# EAGLE design button (EAGLE 9.0.0)
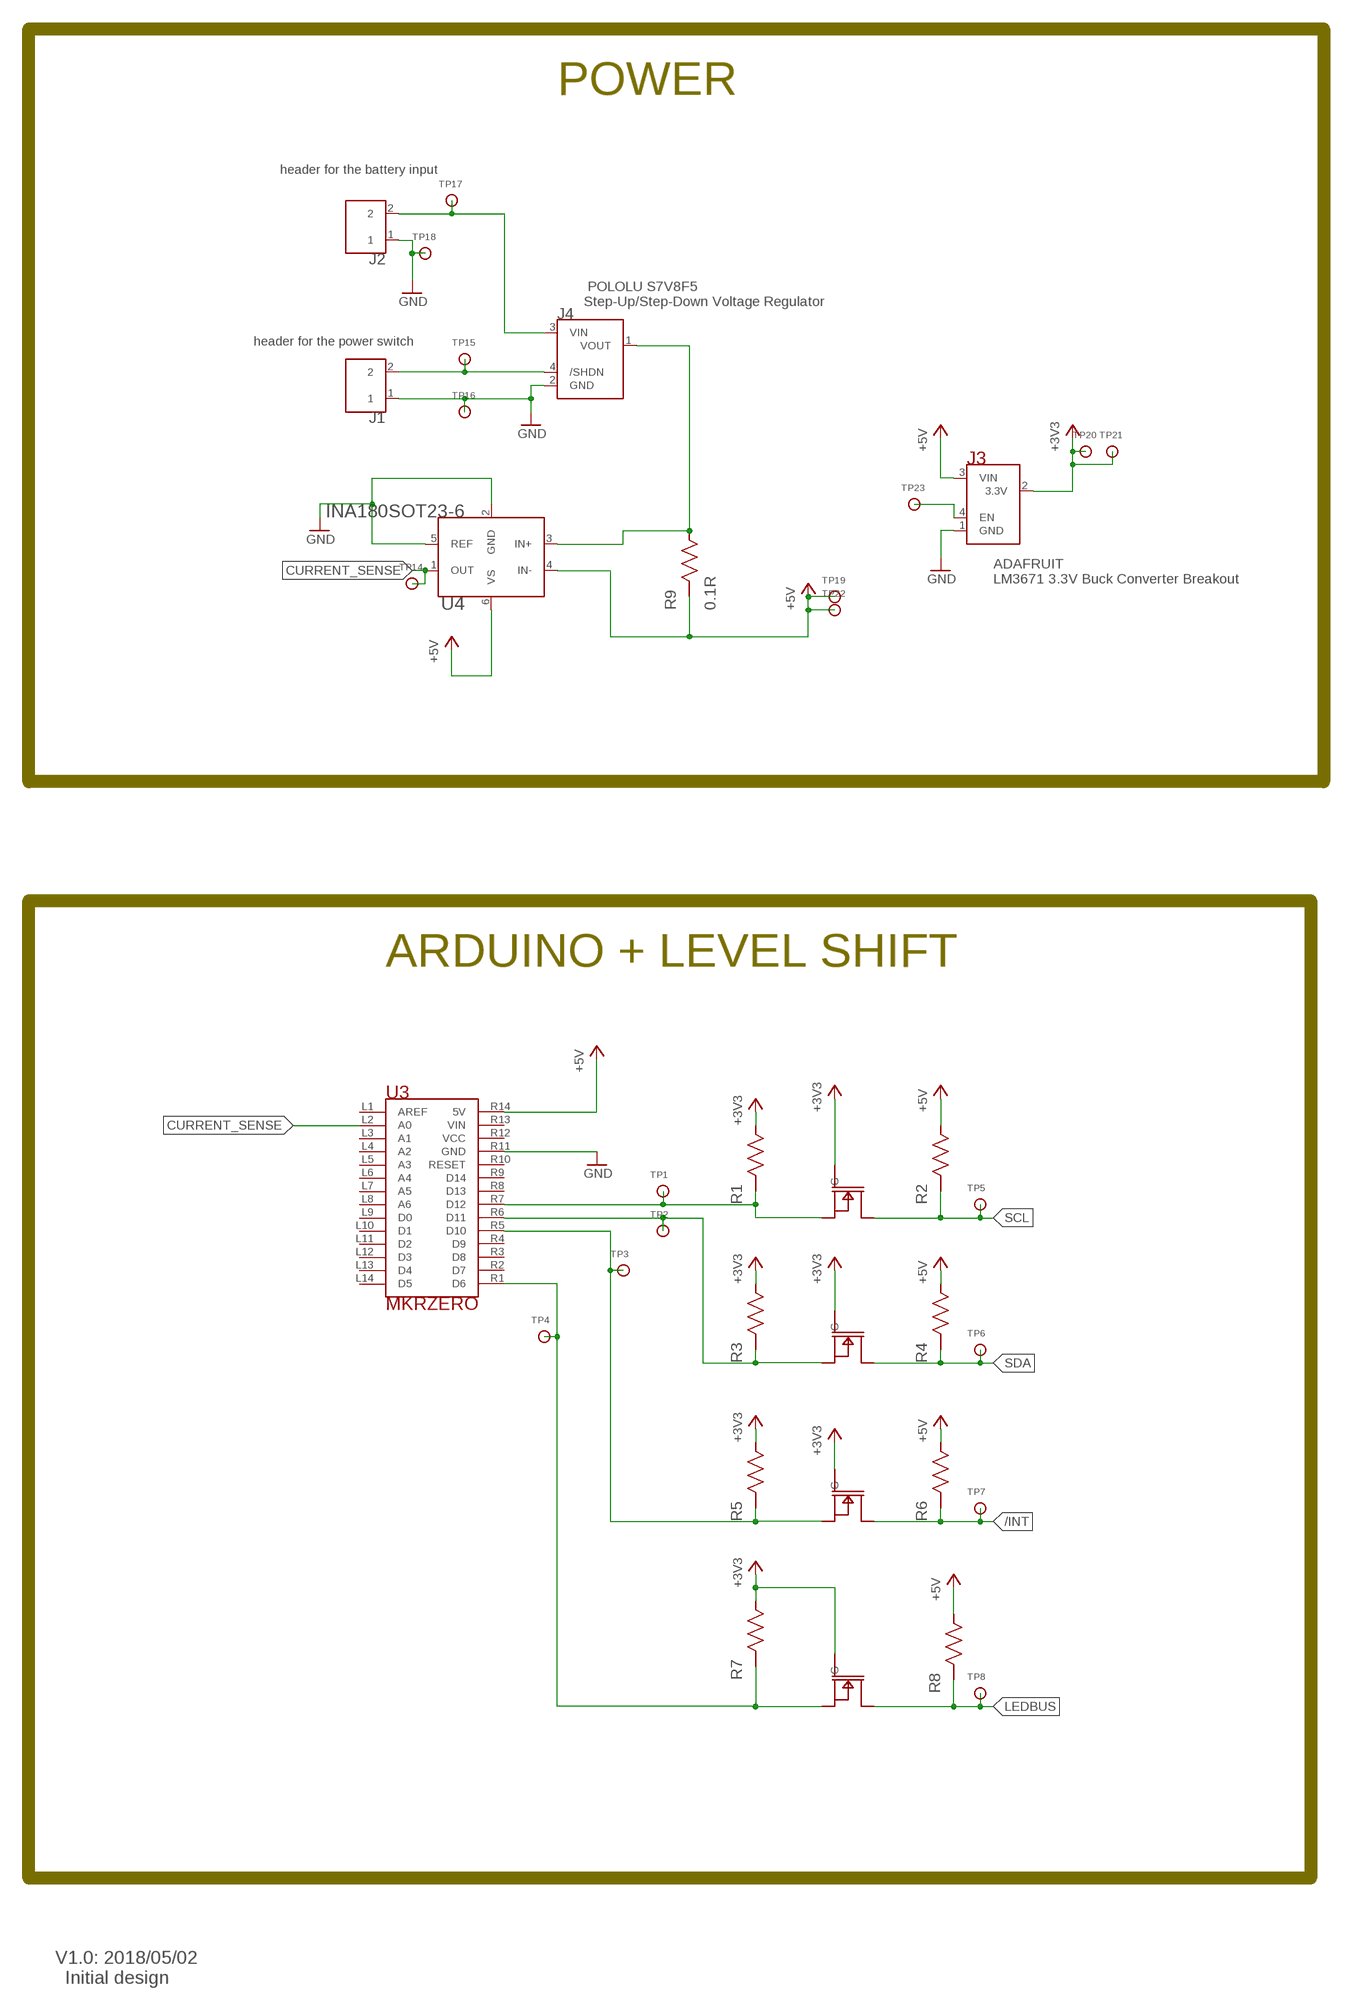
[diagram p0: schematic, sheet 1, part 1 of 2]
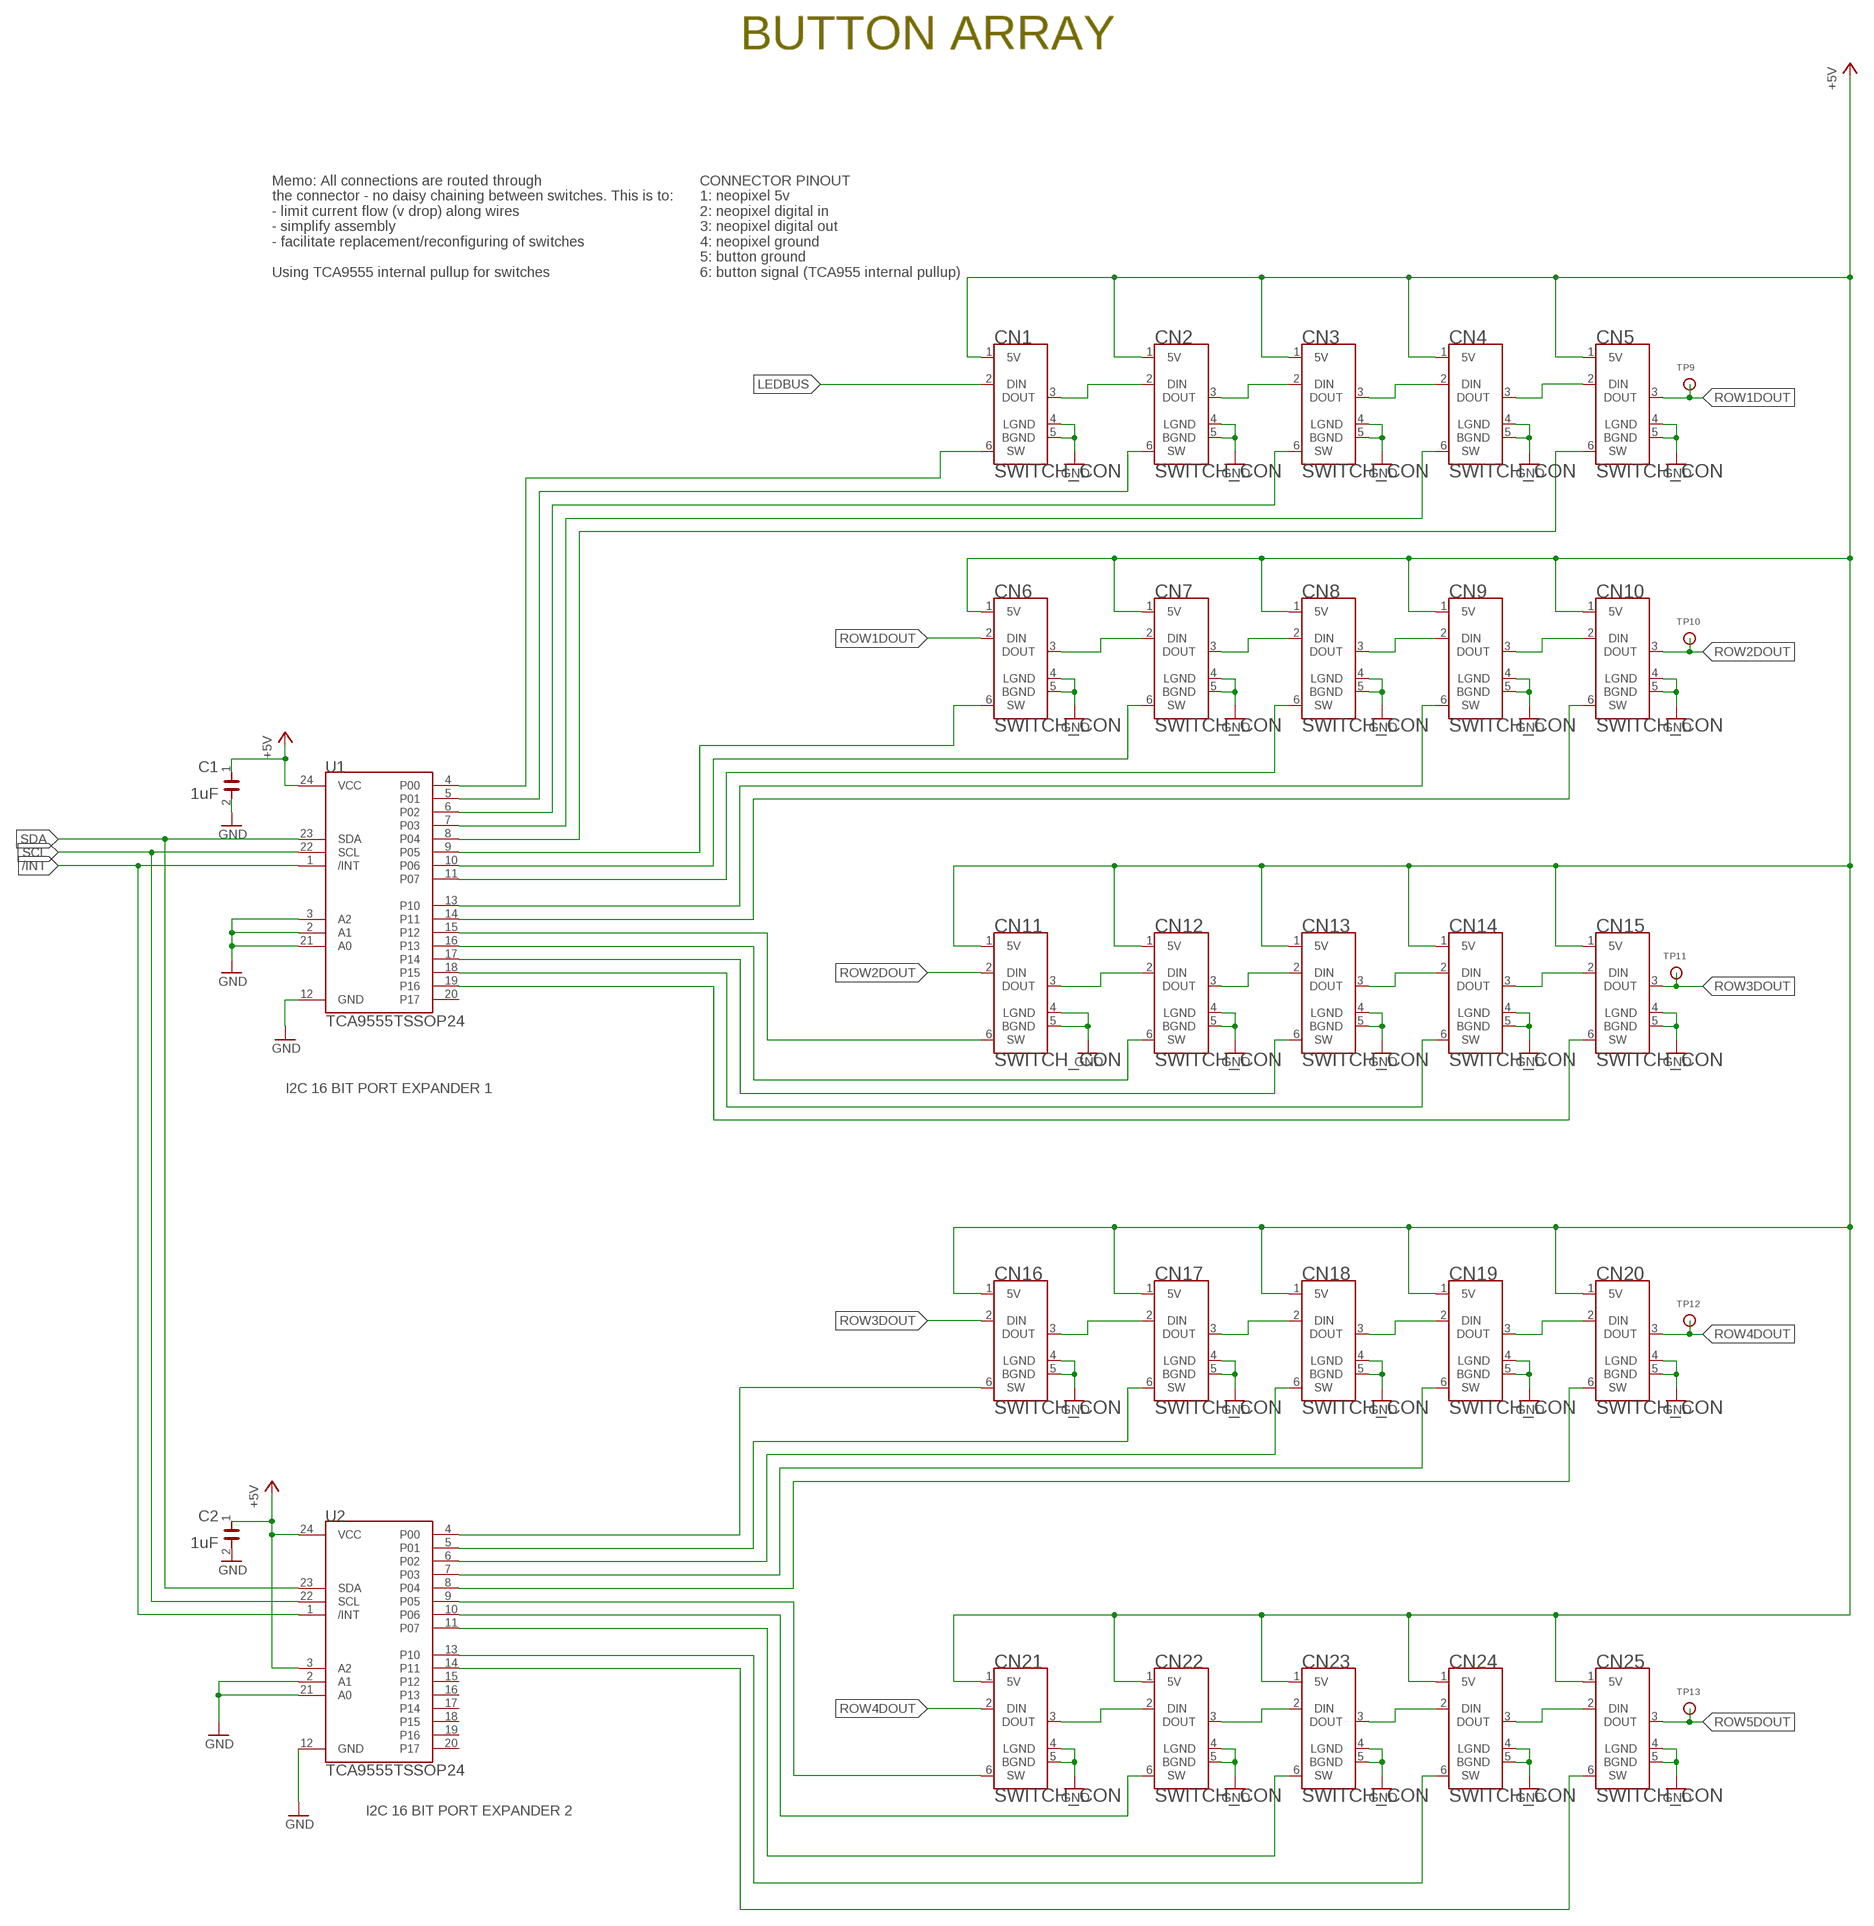
[diagram p1: schematic, sheet 1, part 2 of 2]

## Parts
C1  1uF  CAPACITOR  [R0805]
C2  1uF  CAPACITOR  [R0805]
CN1  SWITCH_CON  [JST_XH6]
CN2  SWITCH_CON  [JST_XH6]
CN3  SWITCH_CON  [JST_XH6]
CN4  SWITCH_CON  [JST_XH6]
CN5  SWITCH_CON  [JST_XH6]
CN6  SWITCH_CON  [JST_XH6]
CN7  SWITCH_CON  [JST_XH6]
CN8  SWITCH_CON  [JST_XH6]
CN9  SWITCH_CON  [JST_XH6]
CN10  SWITCH_CON  [JST_XH6]
CN11  SWITCH_CON  [JST_XH6]
CN12  SWITCH_CON  [JST_XH6]
CN13  SWITCH_CON  [JST_XH6]
CN14  SWITCH_CON  [JST_XH6]
CN15  SWITCH_CON  [JST_XH6]
CN16  SWITCH_CON  [JST_XH6]
CN17  SWITCH_CON  [JST_XH6]
CN18  SWITCH_CON  [JST_XH6]
CN19  SWITCH_CON  [JST_XH6]
CN20  SWITCH_CON  [JST_XH6]
CN21  SWITCH_CON  [JST_XH6]
CN22  SWITCH_CON  [JST_XH6]
CN23  SWITCH_CON  [JST_XH6]
CN24  SWITCH_CON  [JST_XH6]
CN25  SWITCH_CON  [JST_XH6]
J1  2WAY_JUMPER  [2PIN_HEADER]
J2  2WAY_JUMPER  [2PIN_HEADER]
J3  ADA-2745_3V3REG  [4PIN_HEADER]
J4  S7V8F5  [4PIN_HEADER]
Q1  BSS138SOT23  [SOT23]
Q2  BSS138SOT23  [SOT23]
Q3  BSS138SOT23  [SOT23]
Q4  BSS138SOT23  [SOT23]
R1  RESISTOR8085  [R0805]
R2  RESISTOR8085  [R0805]
R3  RESISTOR8085  [R0805]
R4  RESISTOR8085  [R0805]
R5  RESISTOR8085  [R0805]
R6  RESISTOR8085  [R0805]
R7  RESISTOR8085  [R0805]
R8  RESISTOR8085  [R0805]
R9  0.1R  PT1206FR-070R1L1206  [R1206]
TP1  TEST_POINT  [TESTPAD_2MM]
TP2  TEST_POINT  [TESTPAD_2MM]
TP3  TEST_POINT  [TESTPAD_2MM]
TP4  TEST_POINT  [TESTPAD_2MM]
TP5  TEST_POINT  [TESTPAD_2MM]
TP6  TEST_POINT  [TESTPAD_2MM]
TP7  TEST_POINT  [TESTPAD_2MM]
TP8  TEST_POINT  [TESTPAD_2MM]
TP9  TEST_POINT  [TESTPAD_2MM]
TP10  TEST_POINT  [TESTPAD_2MM]
TP11  TEST_POINT  [TESTPAD_2MM]
TP12  TEST_POINT  [TESTPAD_2MM]
TP13  TEST_POINT  [TESTPAD_2MM]
TP14  TEST_POINT  [TESTPAD_2MM]
TP15  TEST_POINT  [TESTPAD_2MM]
TP16  TEST_POINT  [TESTPAD_2MM]
TP17  TEST_POINT  [TESTPAD_2MM]
TP18  TEST_POINT  [TESTPAD_2MM]
TP19  TEST_POINT  [TESTPAD_2MM]
TP20  TEST_POINT  [TESTPAD_2MM]
TP21  TEST_POINT  [TESTPAD_2MM]
TP22  TEST_POINT  [TESTPAD_2MM]
TP23  TEST_POINT  [TESTPAD_2MM]
U1  TCA9555TSSOP24  [SOP65P640X120-24]
U2  TCA9555TSSOP24  [SOP65P640X120-24]
U3  MKRZERO  ATMEL_MLRZERO  [ARDUINO_MKR]
U4  INA180SOT23-6  [SOT95P290X145-6]

## Nets
+3V3: J3.2(3.3V) Q1.1(G) Q2.1(G) Q3.1(G) Q4.1(G) R1.2 R3.2 R5.2 R7.2 TP20.P$1 TP21.P$1
+5V: C1.1 C2.1 CN1.1(5V) CN2.1(5V) CN3.1(5V) CN4.1(5V) CN5.1(5V) CN6.1(5V) CN7.1(5V) CN8.1(5V) CN9.1(5V) CN10.1(5V) CN11.1(5V) CN12.1(5V) CN13.1(5V) CN14.1(5V) CN15.1(5V) CN16.1(5V) CN17.1(5V) CN18.1(5V) CN19.1(5V) CN20.1(5V) CN21.1(5V) CN22.1(5V) CN23.1(5V) CN24.1(5V) CN25.1(5V) J3.3(VIN) R2.2 R4.2 R6.2 R8.2 R9.1 TP19.P$1 TP22.P$1 U1.24(VCC) U2.3(A2) U2.24(VCC) U3.R14(5V) U4.4(IN-) U4.6(VS)
/INT: Q2.3(D) R6.1 TP7.P$1 U1.1(/INT) U2.1(/INT)
CURRENT_SENSE: TP14.P$1 U3.L2(A0) U4.1(OUT)
GND: C1.2 C2.2 CN1.4(LGND) CN1.5(BGND) CN2.4(LGND) CN2.5(BGND) CN3.4(LGND) CN3.5(BGND) CN4.4(LGND) CN4.5(BGND) CN5.4(LGND) CN5.5(BGND) CN6.4(LGND) CN6.5(BGND) CN7.4(LGND) CN7.5(BGND) CN8.4(LGND) CN8.5(BGND) CN9.4(LGND) CN9.5(BGND) CN10.4(LGND) CN10.5(BGND) CN11.4(LGND) CN11.5(BGND) CN12.4(LGND) CN12.5(BGND) CN13.4(LGND) CN13.5(BGND) CN14.4(LGND) CN14.5(BGND) CN15.4(LGND) CN15.5(BGND) CN16.4(LGND) CN16.5(BGND) CN17.4(LGND) CN17.5(BGND) CN18.4(LGND) CN18.5(BGND) CN19.4(LGND) CN19.5(BGND) CN20.4(LGND) CN20.5(BGND) CN21.4(LGND) CN21.5(BGND) CN22.4(LGND) CN22.5(BGND) CN23.4(LGND) CN23.5(BGND) CN24.4(LGND) CN24.5(BGND) CN25.4(LGND) CN25.5(BGND) J1.1 J2.1 J3.1(GND) J4.2(GND) TP16.P$1 TP18.P$1 U1.2(A1) U1.3(A2) U1.12(GND) U1.21(A0) U2.2(A1) U2.12(GND) U2.21(A0) U3.R11(GND) U4.2(GND) U4.5(REF)
LEDBUS: CN1.2(DIN) Q4.3(D) R8.1 TP8.P$1
N$1: CN23.3(DOUT) CN24.2(DIN)
N$2: CN24.3(DOUT) CN25.2(DIN)
N$3: CN1.6(SW) U1.4(P00)
N$4: CN2.6(SW) U1.5(P01)
N$5: CN3.6(SW) U1.6(P02)
N$6: J3.4(EN) TP23.P$1
N$7: CN1.3(DOUT) CN2.2(DIN)
N$8: CN2.3(DOUT) CN3.2(DIN)
N$9: CN3.3(DOUT) CN4.2(DIN)
N$10: CN4.3(DOUT) CN5.2(DIN)
N$11: CN6.3(DOUT) CN7.2(DIN)
N$12: CN7.3(DOUT) CN8.2(DIN)
N$13: CN8.3(DOUT) CN9.2(DIN)
N$14: CN9.3(DOUT) CN10.2(DIN)
N$15: CN11.3(DOUT) CN12.2(DIN)
N$16: CN12.3(DOUT) CN13.2(DIN)
N$17: CN13.3(DOUT) CN14.2(DIN)
N$18: CN14.3(DOUT) CN15.2(DIN)
N$19: CN16.3(DOUT) CN17.2(DIN)
N$20: CN17.3(DOUT) CN18.2(DIN)
N$21: CN18.3(DOUT) CN19.2(DIN)
N$22: CN19.3(DOUT) CN20.2(DIN)
N$23: CN21.3(DOUT) CN22.2(DIN)
N$24: CN22.3(DOUT) CN23.2(DIN)
N$25: CN4.6(SW) U1.7(P03)
N$26: CN5.6(SW) U1.8(P04)
N$27: CN6.6(SW) U1.9(P05)
N$28: CN7.6(SW) U1.10(P06)
N$29: CN8.6(SW) U1.11(P07)
N$30: CN9.6(SW) U1.13(P10)
N$31: CN10.6(SW) U1.14(P11)
N$32: CN11.6(SW) U1.15(P12)
N$33: CN12.6(SW) U1.16(P13)
N$34: CN13.6(SW) U1.17(P14)
N$35: CN14.6(SW) U1.18(P15)
N$36: CN15.6(SW) U1.19(P16)
N$37: CN16.6(SW) U2.4(P00)
N$38: CN17.6(SW) U2.5(P01)
N$39: CN18.6(SW) U2.6(P02)
N$40: CN19.6(SW) U2.7(P03)
N$41: CN20.6(SW) U2.8(P04)
N$42: Q3.2(S) R1.1 TP1.P$1 U3.R7(D12)
N$43: CN21.6(SW) U2.9(P05)
N$44: CN22.6(SW) U2.10(P06)
N$45: CN23.6(SW) U2.11(P07)
N$46: CN24.6(SW) U2.13(P10)
N$47: CN25.6(SW) U2.14(P11)
N$48: Q4.2(S) R7.1 TP4.P$1 U3.R1(D6)
N$49: Q1.2(S) R3.1 TP2.P$1 U3.R6(D11)
N$50: J1.2 J4.4(/SHDN) TP15.P$1
N$51: J2.2 J4.3(VIN) TP17.P$1
N$52: Q2.2(S) R5.1 TP3.P$1 U3.R5(D10)
N$54: J4.1(VOUT) R9.2 U4.3(IN+)
ROW1DOUT: CN5.3(DOUT) CN6.2(DIN) TP9.P$1
ROW2DOUT: CN10.3(DOUT) CN11.2(DIN) TP10.P$1
ROW3DOUT: CN15.3(DOUT) CN16.2(DIN) TP11.P$1
ROW4DOUT: CN20.3(DOUT) CN21.2(DIN) TP12.P$1
ROW5DOUT: CN25.3(DOUT) TP13.P$1
SCL: Q3.3(D) R2.1 TP5.P$1 U1.22(SCL) U2.22(SCL)
SDA: Q1.3(D) R4.1 TP6.P$1 U1.23(SDA) U2.23(SDA)
Unconnected: U1.20(P17) U2.15(P12) U2.16(P13) U2.17(P14) U2.18(P15) U2.19(P16) U2.20(P17) U3.L1(AREF) U3.L3(A1) U3.L4(A2) U3.L5(A3) U3.L6(A4) U3.L7(A5) U3.L8(A6) U3.L9(D0) U3.L10(D1) U3.L11(D2) U3.L12(D3) U3.L13(D4) U3.L14(D5) U3.R2(D7) U3.R3(D8) U3.R4(D9) U3.R8(D13) U3.R9(D14) U3.R10(RESET) U3.R12(VCC) U3.R13(VIN)

## Notes on the sheet
- POWER | BUTTON ARRAY
- header for the battery input
- POLOLU S7V8F5
  Step-Up/Step-Down Voltage Regulator
- Memo: All connections are routed through
  the connector - no daisy chaining between switches. This is to:
  - limit current flow (v drop) along wires
  - simplify assembly
  - facilitate replacement/reconfiguring of switches
  
  Using TCA9555 internal pullup for switches
- CONNECTOR PINOUT
  1: neopixel 5v
  2: neopixel digital in
  3: neopixel digital out
  4: neopixel ground
  5: button ground
  6: button signal (TCA955 internal pullup)
- header for the power switch
- ADAFRUIT
  LM3671 3.3V Buck Converter Breakout
- ARDUINO + LEVEL SHIFT
- I2C 16 BIT PORT EXPANDER 1
- I2C 16 BIT PORT EXPANDER 2
- V1.0: 2018/05/02
    Initial design

## Library data of the parts
C1 C2 = button_lib:CAPACITOR
CN1-CN25 = button_lib:SWITCH_CON
J1 J2 = button_lib:2WAY_JUMPER
J3 = button_lib:ADA-2745_3V3REG
J4 = button_lib:S7V8F5
Q1-Q4 = button_lib:BSS138
R1-R8 = button_lib:RESISTOR
R9 = button_lib:PT1206FR-070R1L: 0.1R 0.25W PT1206FR-070R1L
TP1-TP23 = button_lib:TEST_POINT
U1 U2 = button_lib:TCA9555
U3 = button_lib:ATMEL_MLRZERO
U4 = button_lib:INA180

## Board
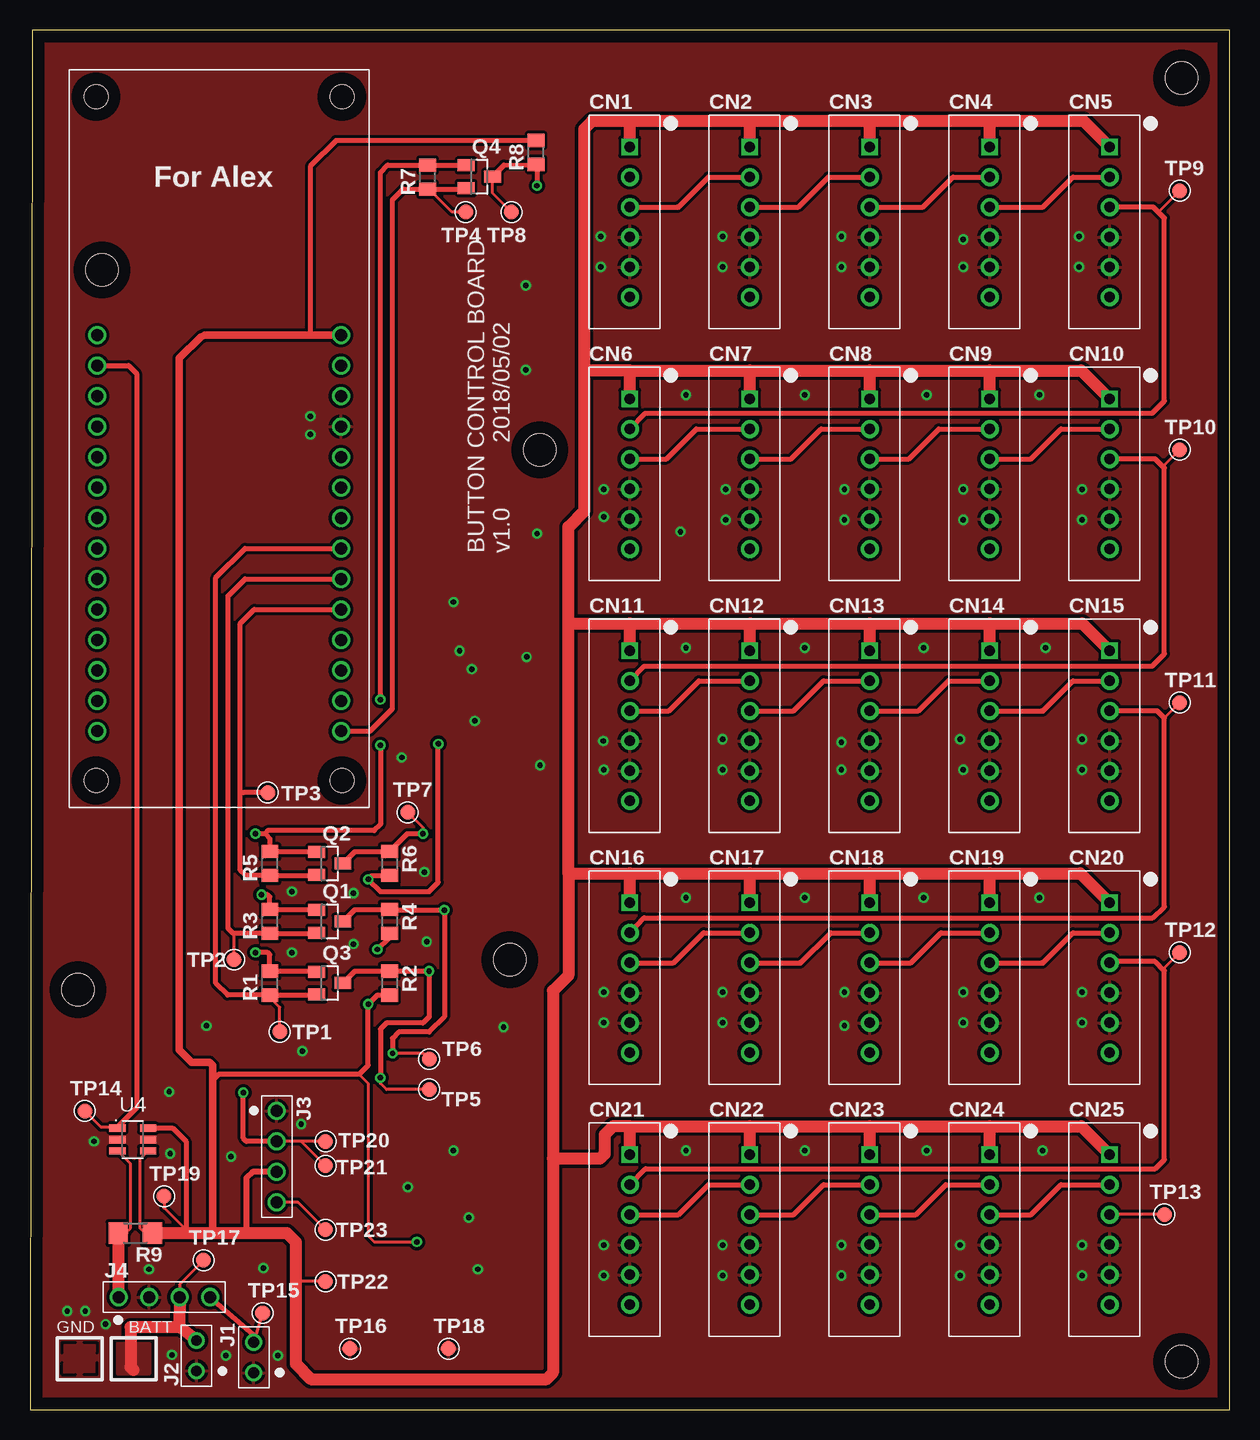
[diagram p2: board, top side]
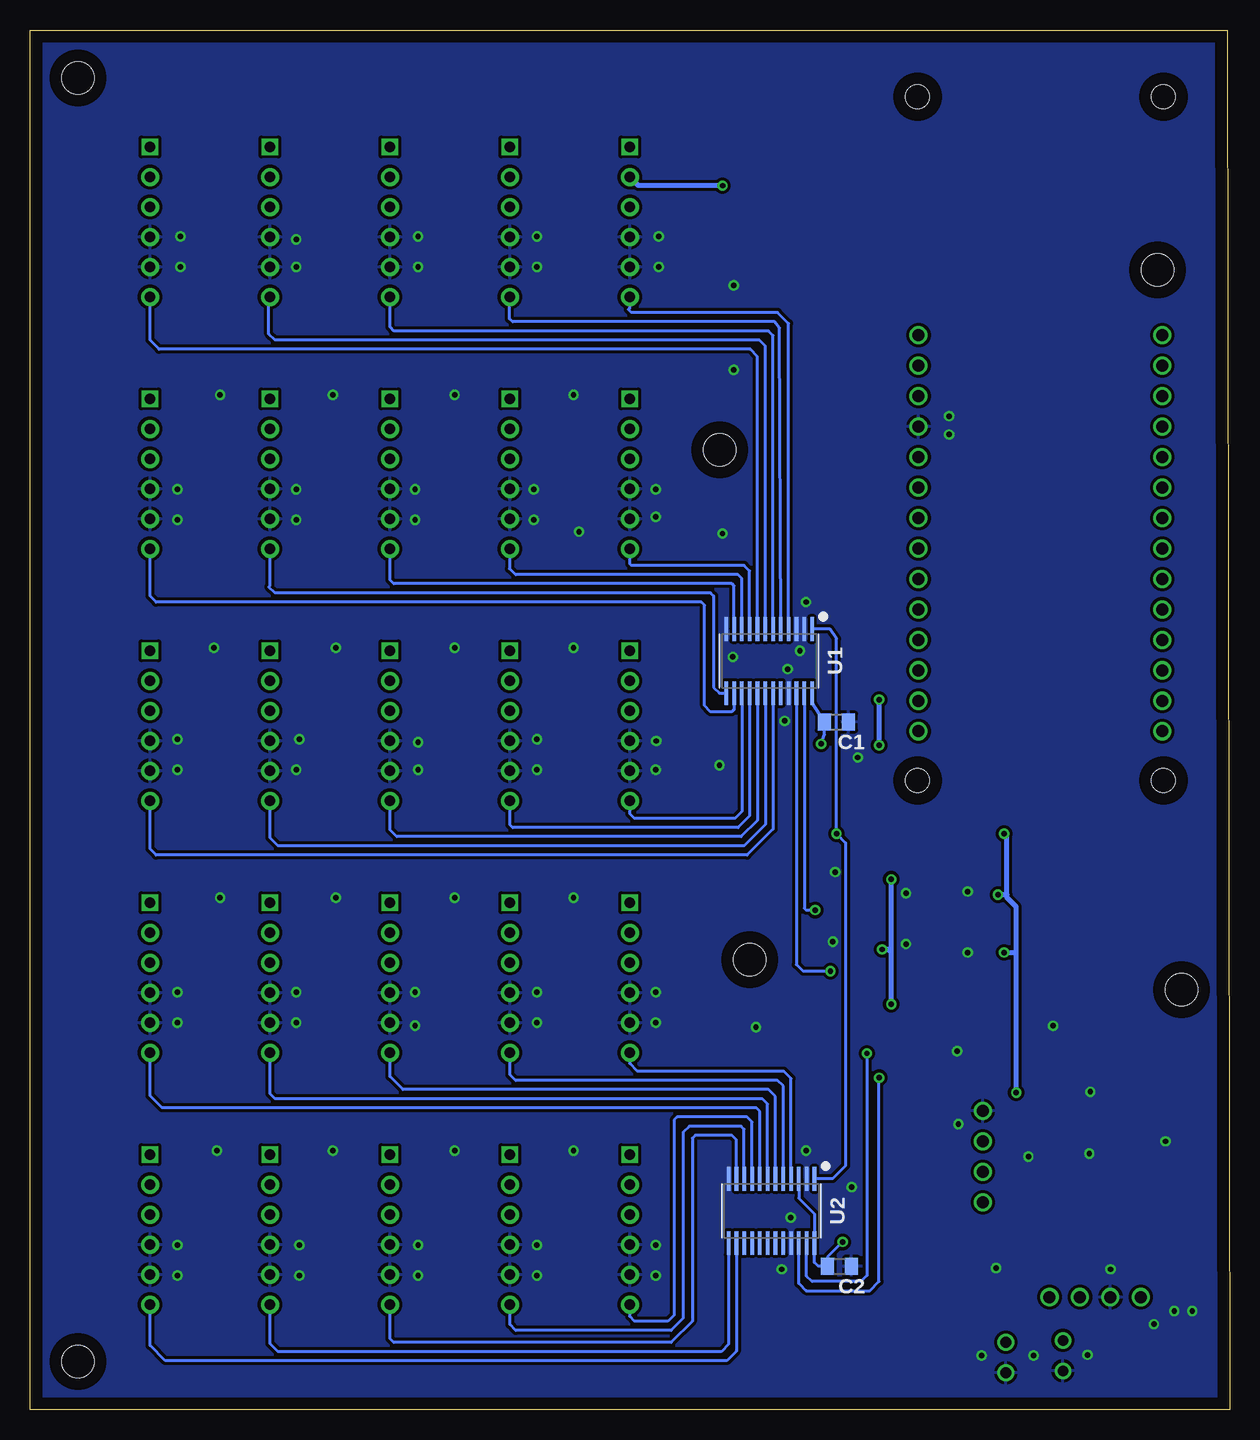
[diagram p3: board, bottom side, seen from below]

Size 100 x 115 mm. Coordinates in mm from the lower left corner, seen from the top.
Outline: 0,0 100,0 100,115 0.2,115 0,0
Copper layers (1*16): Top 0.035mm / dielectric 1.5mm / Bottom 0.035mm
Design rules "default *": minimum track width 6mil, minimum drill 0.35mm, track to track 10mil, track to pad 8mil, pad to pad 8mil, via to via 10mil, smd to smd 6mil, copper to edge 40mil, drill to drill 6mil, minimum pad ring 10mil, minimum via ring 8mil, stop-mask expansion 4mil, vias tented up to drill 0mil, thermal gap 10mil
Holes 2.7 mm at 96,111 96,4 40,37.5 42.5,80 6,95 4,35
tRestrict: 8 lines

### Footprints (pad centres in the part's own frame; a part is rotated, then mirrored left to right if it is on the bottom)
R0805 = smd 1.1 x 1.4: 1 -1,0; 2 1,0
JST_XH6 = drill 0.9 square: 1 -6.25,0 | drill 0.9 pad 1.5: 2 -3.75,0; 3 -1.25,0; 4 1.25,0; 5 3.75,0; 6 6.25,0
2PIN_HEADER = drill 0.9: 1 -1.27,0; 2 1.27,0
4PIN_HEADER = drill 1: 1 -3.81,0; 2 -1.27,0; 3 1.27,0; 4 3.81,0
SOT23 = smd 1 x 1.4: 1 -0.95,-1.1; 2 0.95,-1.1; 3 0,1.1
R1206 = smd 1.6 x 1.803: 1 -1.422,0; 2 1.422,0
TESTPAD_2MM = smd 1.27 x 1.27: P$1 0,0
SOP65P640X120-24 = smd 1.968 x 0.3: 1 -2.673,3.575; 2 -2.673,2.925; 3 -2.673,2.275; 4 -2.673,1.625; 5 -2.673,0.975; 6 -2.673,0.325; 7 -2.673,-0.325; 8 -2.673,-0.975; 9 -2.673,-1.625; 10 -2.673,-2.275; 11 -2.673,-2.925; 12 -2.673,-3.575; 13 2.673,-3.575; 14 2.673,-2.925; 15 2.673,-2.275; 16 2.673,-1.625; 17 2.673,-0.975; 18 2.673,-0.325; 19 2.673,0.325; 20 2.673,0.975; 21 2.673,1.625; 22 2.673,2.275; 23 2.673,2.925; 24 2.673,3.575
ARDUINO_MKR = drill 1 pad 1.5: L1 2.34,39.37; L2 2.34,36.83; L3 2.34,34.29; L4 2.34,31.75; L5 2.34,29.21; L6 2.34,26.67; L7 2.34,24.13; L8 2.34,21.59; L9 2.34,19.05; L10 2.34,16.51; L11 2.34,13.97; L12 2.34,11.43; L13 2.34,8.89; L14 2.34,6.35; R1 22.66,6.35; R2 22.66,8.89; R3 22.66,11.43; R4 22.66,13.97; R5 22.66,16.51; R6 22.66,19.05; R7 22.66,21.59; R8 22.66,24.13; R9 22.66,26.67; R10 22.66,29.21; R11 22.66,31.75; R12 22.66,34.29; R13 22.66,36.83; R14 22.66,39.37 | hole 2: 2.25,2.25; 22.75,2.25; 22.75,59.25; 2.25,59.25
SOT95P290X145-6 = smd 1.35 x 0.609: 1 -1.28,0.95; 2 -1.28,0; 3 -1.28,-0.95; 4 1.28,-0.95; 5 1.28,0; 6 1.28,0.95

### Placement (x,y rotation side)
C1  32.77,57.31 0 bottom
C2  32.51,11.94 0 bottom
CN1  50,99 270 top
CN2  60,99 270 top
CN3  70,99 270 top
CN4  80,99 270 top
CN5  90,99 270 top
CN6  50,78 270 top
CN7  60,78 270 top
CN8  70,78 270 top
CN9  80,78 270 top
CN10  90,78 270 top
CN11  50,57 270 top
CN12  60,57 270 top
CN13  70,57 270 top
CN14  80,57 270 top
CN15  90,57 270 top
CN16  50,36 270 top
CN17  60,36 270 top
CN18  70,36 270 top
CN19  80,36 270 top
CN20  90,36 270 top
CN21  50,15 270 top
CN22  60,15 270 top
CN23  70,15 270 top
CN24  80,15 270 top
CN25  90,15 270 top
J1  18.65,4.34 90 top
J2  13.88,4.48 90 top
J3  20.57,21.08 270 top
J4  11.19,9.37 0 top
Q1  24.99,40.68 270 top
Q2  24.99,45.51 270 top
Q3  24.99,35.55 270 top
Q4  37.46,102.77 270 top
R1  19.99,35.55 90 top
R2  29.97,35.55 270 top
R3  19.99,40.68 90 top
R4  29.97,40.68 270 top
R5  19.99,45.51 90 top
R6  29.97,45.51 270 top
R7  33.15,102.73 90 top
R8  42.18,104.78 90 top
R9  8.78,14.71 180 top
TP1  20.83,31.5 90 top
TP2  17.02,37.5 0 top
TP3  19.82,51.42 180 top
TP4  36.32,99.82 180 top
TP5  33.27,26.67 270 top
TP6  33.27,29.21 270 top
TP7  31.5,49.78 0 top
TP8  40.13,99.82 180 top
TP9  95.84,101.6 0 top
TP10  95.84,80.01 0 top
TP11  95.84,58.93 0 top
TP12  95.84,38.1 0 top
TP13  94.57,16.26 0 top
TP14  4.57,24.89 0 top
TP15  19.4,8.04 0 top
TP16  26.67,5.08 0 top
TP17  14.48,12.45 0 top
TP18  34.88,5.08 0 top
TP19  11.18,17.78 0 top
TP20  24.64,22.35 0 top
TP21  24.64,20.32 180 top
TP22  24.64,10.67 0 top
TP23  24.64,14.99 0 top
U1  38.38,62.39 270 bottom
U2  38.18,16.56 270 bottom
U3  3.26,50.19 0 top
U4  8.58,22.51 0 top

### Tracks (layer width: path | path; a pad name or v marks a point on that pad's centre or on a via)
+3V3  (via drill 0.45)
  Top 0.254: TP20.P$1 22.61,22.35 | 22.61,22.35 J3.2 | TP21.P$1 22.61,22.35
  Top 0.406: Q4.1 R7.2 29.82,103.73 29.21,103.12 v29.21,59.18 | Q2.1 23.84,46.51 R5.2 19.99,47.57 19.66,48.01 | Q1.1 23.84,41.68 R3.2 19.99,42.75 19.81,42.93 v19.3,42.93 | Q3.1 23.84,36.55 R1.2 19.99,37.92 19.81,38.1 v18.8,38.1 | J3.2 18.03,22.35 17.78,22.61 v17.78,26.42 | v18.8,48.01 19.66,48.01 | v29.21,55.37 29.21,48.77 28.7,48.26 19.81,48.26 19.66,48.01
  Top 0.508: 19.81,46.69 R5.2
  Bottom 0.406: v17.78,26.42 17.78,38.1 | 17.78,38.1 17.78,41.91 18.54,42.67 18.54,42.93 | 18.54,42.93 18.54,48.01 v18.8,48.01 | v19.3,42.93 18.54,42.93 | v18.8,38.1 17.78,38.1 | v29.21,59.18 v29.21,55.37
+5V  (via drill 0.45)
  Top 0.254: U4.4 9.18,20.88 9.18,15.11 9.38,14.91 10,14.91 | 27.43,27.94 28.19,27.18 28.19,14.48 28.7,13.97 v32.26,13.97 | TP19.P$1 11.18,16.81 13,14.99 | TP22.P$1 22.15,10.67
  Top 0.406: R9.1 10,14.91 | U4.6 11.89,23.46 13,22.35 13,14.99 13,14.71 | v28.96,38.35 29.97,39.37 R4.2 | R6.2 28.51,44.51 v28.19,44.2 29.21,43.18 33.27,43.18 34.04,43.94 v34.04,55.49 | R8.2 25.52,105.78 23.37,103.63 23.37,89.56 | R2.2 28.96,34.55 v28.19,33.78 28.19,28.7 27.43,27.94 15.75,27.94 15.24,27.43
  Top 0.508: J3.3 18.54,19.81 18.03,19.3 18.03,14.71
  Top 0.61: U3.R14 23.37,89.56 14.58,89.56 14.22,89.41 12.45,87.63 12.45,29.97 13.46,28.96 14.99,28.96 15.24,28.7 15.24,27.43 15.24,14.71
  Top 1.016: R9.1 13,14.71 15.24,14.71 18.03,14.71 21.4,14.71 22.15,13.97 22.15,10.67 22.15,3.81 23.42,2.54 43.07,2.54 43.6,3.07 43.6,20.9 | 44.88,44.7 44.88,65.53 | 50,23.62 60,23.62 | 60,23.62 70,23.62 | 70,23.62 80,23.62 | 80,23.62 87.63,23.62 CN25.1 | 44.88,44.7 50,44.7 | 50,44.7 60,44.7 | 60,44.7 70,44.7 | 70,44.7 80,44.7 | 80,44.7 87.55,44.7 CN20.1 | 44.88,65.53 50,65.53 | 50,65.53 60.02,65.53 | 60.02,65.53 70,65.53 | 70,65.53 80,65.53 | 80,65.53 87.72,65.53 CN15.1 | 50,86.61 60,86.61 | 60,86.61 70,86.61 | 70,86.61 80,86.61 | 80,86.61 87.64,86.61 CN10.1 | 50.12,107.44 46.89,107.44 46.2,106.73 46.2,86.6 | 50.12,107.44 60.02,107.44 | 60.02,107.44 70,107.44 | 70,107.44 80,107.44 | 80,107.44 87.81,107.44 CN5.1 | CN2.1 60,107.42 60.02,107.44 | CN1.1 50,107.32 50.12,107.44 | CN3.1 70,107.44 | CN4.1 80,107.44 | CN6.1 50,86.61 | CN7.1 60,86.61 | CN8.1 70,86.61 | CN9.1 80,86.61 | CN11.1 50,65.53 | CN12.1 60.02,63.25 60.02,65.53 | CN13.1 70,65.53 | CN14.1 80,65.53 | CN16.1 50,44.7 | CN17.1 60,44.7 | CN18.1 70,44.7 | CN19.1 80,44.7 | CN21.1 50,23.62 | CN22.1 60,23.62 | CN23.1 70,23.62 | CN24.1 80,23.62 | 44.88,44.7 44.88,36.18 43.6,34.9 43.6,20.9 | 50,23.62 48.62,23.62 47.9,22.9 47.9,21.3 47.5,20.9 43.6,20.9 | 44.88,65.53 44.88,73.58 46.2,74.9 46.2,86.6 | 50,86.61 46.21,86.61 46.2,86.6
  Bottom 0.254: U2.3 35.91,17.62 34.6,16.32 U2.24 34.6,12.25 34.29,11.94 C2.1 33.51,12.72 v32.26,13.97 | v34.04,55.49 33.77,56.26 C1.1 34.8,58.95 U1.24
  Bottom 0.406: v28.19,33.78 28.19,38.1 | 28.19,38.1 28.45,38.35 v28.96,38.35 | 28.19,38.1 v28.19,44.2
/INT  (via drill 0.45)
  Top 0.254: TP7.P$1 32.77,48.51 v32.77,48.01
  Top 0.406: Q2.3 27.09,46.51 R6.1 31.47,48.01 v32.77,48.01
  Bottom 0.254: U1.1 33.31,65.06 32.77,64.26 v32.77,48.01 32,47.24 32,20.32 33.09,19.23 U2.1
CURRENT_SENSE
  Top 0.254: TP14.P$1 5.91,23.56 7.3,23.56
  Top 0.406: U3.L2 8.23,87.02 8.89,86.36 8.89,25.15 7.3,23.56 U4.1
GND  (via drill 0.45)
  other vias: 47.58,97.79 47.58,95.25 57.74,97.79 67.64,97.79 77.8,97.54 87.46,97.79 87.46,95.25 77.8,95.25 67.64,95.25 57.74,95.25 47.83,76.71 47.83,74.42 57.99,76.71 57.99,74.17 67.9,76.71 67.9,74.17 77.8,76.71 77.8,74.17 87.71,76.71 87.71,74.17 84.15,84.58 74.76,84.58 64.6,84.58 54.69,84.58 54.69,63.5 64.6,63.5 74.5,63.5 84.66,63.5 87.71,55.88 87.71,53.34 77.55,55.88 77.8,53.34 67.64,55.63 67.64,53.34 57.74,55.88 57.74,53.34 47.79,55.73 47.83,53.34 54.69,42.67 64.6,42.67 74.5,42.67 84.15,42.67 47.83,34.8 47.83,32.26 57.74,34.8 57.74,32.26 67.9,34.8 67.9,32 77.8,34.8 77.8,32.26 87.71,34.8 87.71,32.26 54.69,21.59 64.6,21.59 74.76,21.59 84.41,21.59 47.83,13.72 47.83,11.18 57.74,13.72 57.74,11.18 67.64,13.72 67.64,11.18 77.55,13.72 77.55,11.18 87.71,13.72 87.71,11.18 37.34,11.68 36.58,16 35.31,21.59 39.48,31.86 16.76,21.08 22.61,23.78 11.68,21.34 5.33,22.35 21.84,38.1 21.84,43.18 26.97,43.03 26.97,38.81 30.99,54.36 37.08,57.4 36.83,61.72 35.81,63.25 41.4,62.74 42.52,53.71 42.27,73.02 54.23,73.18 41.33,86.68 41.33,93.71 35.31,67.31 9.91,11.68 6.3,7.11 16.34,4.5 20.67,4.5 19.46,11.8 11.83,4.56 31.5,18.54 23.37,82.8 23.37,81.28 3.1,8.21 4.6,8.21 22.71,29.88 11.61,26.48 14.71,31.98 33.07,39.01 32.87,44.81
  pour Top (rank 4): 0,115 100,115 100,0 0,0 0.06,110.44
  pour Bottom (rank 2): 3.2,114.99 100,115 100,0 0,0 0,115
  pour Top: 2.75,5.5 2.75,3 5.5,3 5.5,5.5
LEDBUS  (via drill 0.45)
  Top 0.254: TP8.P$1 38.56,101.4 Q4.3
  Top 0.406: Q4.3 39.52,103.73 R8.1 42.26,103.43 v42.27,102.02
  Bottom 0.406: v42.27,102.02 49.27,102.02 CN1.2
N$1
  Top 0.406: CN23.3 73.85,16.25 76.35,18.75 CN24.2
N$2
  Top 0.406: CN24.3 83.45,16.25 85.95,18.75 CN25.2
N$3
  Bottom 0.254: CN1.6 50,91.81 50.12,91.69 49.86,91.44 37.67,91.44 36.76,90.52 U1.4
N$4
  Bottom 0.254: CN2.6 60.02,92.73 60.02,90.93 59.77,90.68 37.93,90.68 37.51,90.16 U1.5
N$5
  Bottom 0.254: U1.6 38.05,89.54 38.43,89.92 69.68,89.92 70,90.24 CN3.6
N$6
  Top 0.254: TP23.P$1 22.35,17.27 J3.4
N$7
  Top 0.406: CN1.3 53.95,100.25 54,100.2 56.55,102.75 CN2.2
N$8
  Top 0.406: CN2.3 64.05,100.25 66.55,102.75 CN3.2
N$9
  Top 0.406: CN3.3 74.45,100.25 76.95,102.75 CN4.2
N$10
  Top 0.406: CN4.3 84.45,100.25 86.95,102.75 CN5.2
N$11
  Top 0.406: CN6.3 53.05,79.25 55.55,81.75 CN7.2
N$12
  Top 0.406: CN7.3 63.45,79.25 65.95,81.75 CN8.2
N$13
  Top 0.406: CN8.3 73.25,79.25 75.75,81.75 CN9.2
N$14
  Top 0.406: CN9.3 83.45,79.25 85.95,81.75 CN10.2
N$15
  Top 0.406: CN11.3 53.25,58.25 55.75,60.75 CN12.2
N$16
  Top 0.406: CN12.3 63.65,58.25 66.15,60.75 CN13.2
N$17
  Top 0.406: CN13.3 74.05,58.25 76.55,60.75 CN14.2
N$18
  Top 0.406: CN14.3 84.35,58.25 84.4,58.2 86.95,60.75 CN15.2
N$19
  Top 0.406: CN16.3 53.65,37.25 56.15,39.75 CN17.2
N$20
  Top 0.406: CN17.3 64.15,37.25 64.2,37.2 66.75,39.75 CN18.2
N$21
  Top 0.406: CN18.3 73.45,37.25 75.95,39.75 CN19.2
N$22
  Top 0.406: CN19.3 84.35,37.25 84.4,37.2 86.95,39.75 CN20.2
N$23
  Top 0.406: CN21.3 54.05,16.25 56.55,18.75 CN22.2
N$24
  Top 0.406: CN22.3 63.65,16.25 66.15,18.75 CN23.2
N$25
  Bottom 0.254: U1.7 38.7,88.66 39.2,89.15 79.58,89.15 80.09,89.66 80.09,92.66 CN4.6
N$26
  Bottom 0.254: U1.8 39.35,87.79 39.96,88.39 89.23,88.39 90,89.16 CN5.6
N$27
  Bottom 0.254: U1.9 40.01,69.9 40.47,70.36 49.86,70.36 50,70.49 CN6.6
N$28
  Bottom 0.254: U1.10 40.66,69.28 40.97,69.6 59.52,69.6 60.02,70.1 60,70.13 CN7.6
N$29
  Bottom 0.254: U1.11 41.3,68.66 41.48,68.83 69.68,68.83 70,69.16 CN8.6
N$30
  Bottom 0.254: CN9.6 80,68.67 80.09,68.58 79.58,68.07 43.26,68.07 43.01,67.82 43.01,60.2 42.52,59.72 U1.13
N$31
  Bottom 0.254: U1.14 41.3,58.34 41.48,58.17 43.26,58.17 43.77,58.67 43.77,67.06 44.02,67.31 89.49,67.31 90,67.82 CN10.6
N$32
  Bottom 0.254: U1.15 40.66,49.85 41.23,49.28 49.61,49.28 50,49.67 CN11.6
N$33
  Bottom 0.254: U1.16 40.01,49.48 40.97,48.51 59.77,48.51 60,48.74 CN12.6
N$34
  Bottom 0.254: U1.17 39.35,49.12 40.72,47.75 69.42,47.75 70,48.33 CN13.6
N$35
  Bottom 0.254: U1.18 38.7,48.75 40.47,46.99 79.33,46.99 80,47.66 CN14.6
N$36
  Bottom 0.254: U1.19 38.05,48.38 40.21,46.23 89.49,46.23 90,46.74 CN15.6
N$37
  Bottom 0.254: U2.4 36.55,27.59 37.16,28.19 49.36,28.19 50,28.84 CN16.6
N$38
  Bottom 0.254: U2.5 37.2,26.96 37.67,27.43 59.52,27.43 60,27.92 CN17.6
N$39
  Bottom 0.254: U2.6 37.85,26.09 38.43,26.67 68.91,26.67 70,27.76 CN18.6
N$40
  Bottom 0.254: U2.7 38.51,25.47 38.94,25.91 79.58,25.91 80,26.33 CN19.6
N$41
  Bottom 0.254: U2.8 39.16,24.85 39.45,25.15 88.98,25.15 90,26.17 CN20.6
N$42
  Top 0.254: TP1.P$1 20.83,33.53 19.81,34.55
  Top 0.406: Q3.2 23.84,34.55 R1.1 19.81,34.55 16.47,34.55 15.49,35.53 15.49,69.34 17.93,71.78 U3.R7
N$43
  Bottom 0.254: U2.9 39.8,23.98 40.21,24.38 46.05,24.38 46.31,24.13 46.31,7.87 46.82,7.37 49.61,7.37 50,7.76 CN21.6
N$44
  Bottom 0.254: U2.10 40.47,19.24 40.47,23.37 40.72,23.62 45.04,23.62 45.55,23.11 45.55,7.62 46.56,6.6 59.52,6.6 60,7.09 CN22.6
N$45
  Bottom 0.254: U2.11 41.1,22.48 41.48,22.86 44.53,22.86 44.78,22.61 44.78,7.37 46.56,5.59 69.68,5.59 70,5.91 CN23.6
N$46
  Bottom 0.254: U2.13 41.76,5.44 42.37,4.83 79.33,4.83 80,5.5 CN24.6
N$47
  Bottom 0.254: U2.14 41.1,4.87 41.91,4.06 88.73,4.06 90,5.34 CN25.6
N$48
  Top 0.254: TP4.P$1 35.19,99.82 33.27,101.73
  Top 0.406: Q4.2 36.27,101.73 33.27,101.73 R7.1 31.12,101.73 30.23,100.84 30.23,58.42 28.35,56.54 U3.R1
N$49
  Top 0.254: TP2.P$1 17.02,39.68
  Top 0.406: Q1.2 23.84,39.68 R3.1 17.02,39.68 16.94,39.68 16.51,40.12 16.51,67.82 17.93,69.24 U3.R6
N$50
  Top 0.254: TP15.P$1 19.35,8 J1.2
  Top 0.406: J4.4 18.65,6.22 J1.2
N$51
  Top 0.254: TP17.P$1 12.46,10.43 J4.3
  Top 1.016: J4.3 12.46,6.92 | 12.46,6.92 J2.2 | 12.46,6.92 12.4,6.86 8.38,6.86 8.38,3.56 8.64,3.3
  pour Top: 7.25,5.5 7.25,3 10,3 10,5.5
N$52
  Top 0.406: Q2.2 23.84,44.51 R5.1 17.98,44.51 17.53,44.96 17.53,51.3 | 17.53,51.3 17.53,65.53 18.7,66.7 U3.R5 | TP3.P$1 17.81,51.42 17.53,51.3
N$54
  Top 0.254: 7.98,14.71 8.38,15.11 8.38,20.48 U4.3
  Top 0.406: 7.98,14.71 R9.2 7.35,14.7
  Top 1.016: R9.2 7.38,14.73 | J4.1 7.38,14.69 R9.2
ROW1DOUT
  Top 0.254: TP9.P$1 94.06,99.82
  Top 0.406: CN6.2 51.31,83.06 93.55,83.06 94.57,84.07 94.57,99.31 94.06,99.82 93.63,100.25 CN5.3
ROW2DOUT
  Top 0.254: TP10.P$1 94.57,78.74 94.57,78.49
  Top 0.406: CN11.2 51.23,61.98 93.55,61.98 94.57,62.99 94.57,78.49 93.8,79.25 CN10.3
ROW3DOUT
  Top 0.254: TP11.P$1 94.57,57.66
  Top 0.406: CN16.2 51.19,40.99 93.6,40.99 94.57,41.91 94.57,57.66 93.98,58.25 CN15.3
ROW4DOUT
  Top 0.254: TP12.P$1 94.57,36.83 94.57,36.58
  Top 0.406: CN21.2 51.32,20.07 93.81,20.07 94.57,20.83 94.57,36.58 93.81,37.34 90.09,37.34 CN20.3
ROW5DOUT
  Top 0.254: TP13.P$1 CN25.3
SCL  (via drill 0.45)
  Top 0.254: TP5.P$1 29.72,26.67 29.21,27.18 v29.21,27.65
  Top 0.406: Q3.3 27.09,36.55 R2.1 32.52,36.55 v33.27,36.54 33.27,32.73 32.77,32.23 29.72,32.23 29.21,31.72 v29.21,27.65
  Bottom 0.254: v33.27,36.54 35.56,36.54 36.1,37.09 U1.22 | U2.22 35.91,10.51 35.31,9.91 29.97,9.91 29.21,10.67 v29.21,27.65
SDA  (via drill 0.45)
  Top 0.254: TP6.P$1 32.8,29.69 v30.23,29.69
  Top 0.406: Q1.3 27.09,41.68 R4.1 30.01,41.64 v34.54,41.64 34.54,32.73 33.27,31.46 30.73,31.46 30.23,30.96 v30.23,29.69
  Bottom 0.254: U1.23 35.45,41.79 35.31,41.64 v34.54,41.64 | U2.23 35.26,11.12 34.8,10.67 30.73,10.67 30.23,11.18 v30.23,29.69

### Text on the board
tPlace: For Alex
tNames: BUTTON CONTROL BOARD / v1.0 2018/05/02 | GND | BATT